# Altium schematic sheet Display.SchDoc
size A4; Organization: Rotronic AG; Address1: Grindelstrasse 6; Address2: 8303 Bassersdorf; Address3: Switzerland; DocumentNumber: 4; SheetNumber: 4; SheetTotal: 10; Web_Address: www.rotronic.ch; E_Mail_Address: *@rotronic.ch; Fon: +41 (0)44 838 11 11; Fax: +41 (0)44 836 44 24
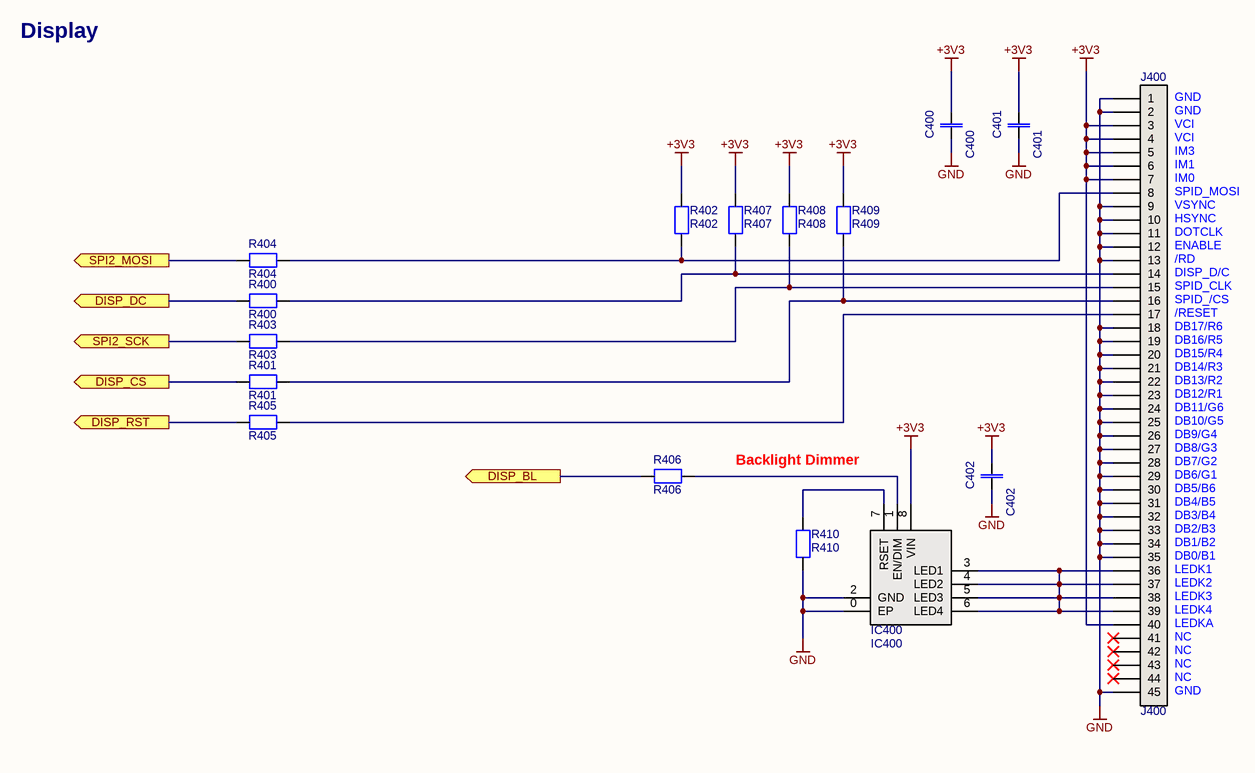
[diagram p0: Display.SchDoc]

## Parts
C400  C400  [0805-2012]
C401  C401  [0603-1608]
C402  C402  [0603-1608]
IC400  IC400  [UDFN-8 517AW-01]
J400  J400  [SAMTEC_ZF5S-45-01-T-WT]
R400  R400  [0603-1608]
R401  R401  [0603-1608]
R402  R402  [0603-1608]
R403  R403  [0603-1608]
R404  R404  [0603-1608]
R405  R405  [0603-1608]
R406  R406  [0603-1608]
R407  R407  [0603-1608]
R408  R408  [0603-1608]
R409  R409  [0603-1608]
R410  R410  [0603-1608]

## Ports
DISP_BL (out), DISP_CS (out), DISP_DC (out), DISP_RST (out), SPI2_MOSI (out), SPI2_SCK (out)

## Nets
+3V3: C400.1 C401.1 C402.1 IC400.8(VIN) J400.3 J400.4 J400.5 J400.6 J400.7 J400.40 R402.2 R407.2 R408.2 R409.2
GND: C400.2 C401.2 C402.2 IC400.0(EP) IC400.2(GND) J400.1 J400.2 J400.9 J400.10 J400.11 J400.12 J400.13 J400.18 J400.19 J400.20 J400.21 J400.22 J400.23 J400.24 J400.25 J400.26 J400.27 J400.28 J400.29 J400.30 J400.31 J400.32 J400.33 J400.34 J400.35 J400.45 R410.2
DISP_BL: R406.2 ; port DISP_BL
DISP_CS: R401.2 ; port DISP_CS
DISP_DC: R400.2 ; port DISP_DC
DISP_RST: R405.2 ; port DISP_RST
SPI2_MOSI: R404.2 ; port SPI2_MOSI
SPI2_SCK: R403.2 ; port SPI2_SCK
NetIC400_1: IC400.1(EN/DIM) R406.1
NetIC400_3: IC400.3(LED1) IC400.4(LED2) IC400.5(LED3) IC400.6(LED4) J400.36 J400.37 J400.38 J400.39
NetIC400_7: IC400.7(RSET) R410.1
NetJ400_8: J400.8 R402.1 R404.1
NetJ400_14: J400.14 R400.1 R407.1
NetJ400_15: J400.15 R403.1 R408.1
NetJ400_16: J400.16 R401.1 R409.1
NetJ400_17: J400.17 R405.1

Not connected (* = marked no-connect by the designer): J400 41* 42* 43* 44*

## Notes on the sheet
- Display
- (near J400) GND
- (near J400) VCI
- (near J400) IM3
- (near J400) IM1
- (near J400) IM0
- (near J400) SPID_MOSI
- (near J400) VSYNC
- (near J400) HSYNC
- (near J400) DOTCLK
- (near J400) ENABLE
- (near J400) /RD
- (near J400) DISP_D/C
- (near J400) /RESET
- (near J400) SPID_/CS
- (near J400) SPID_CLK
- (near J400) DB17/R6
- (near J400) DB16/R5
- (near J400) DB15/R4
- (near J400) DB14/R3
- (near J400) DB13/R2
- (near J400) DB12/R1
- (near J400) DB11/G6
- (near J400) DB8/G3
- (near J400) DB9/G4
- (near J400) DB10/G5
- Backlight Dimmer
- (near J400) DB4/B5
- (near J400) DB5/B6
- (near J400) DB6/G1
- (near J400) DB7/G2
- (near J400) DB0/B1
- (near J400) DB1/B2
- (near J400) DB2/B3
- (near J400) DB3/B4
- (near J400) LEDK1
- (near J400) LEDK2
- (near J400) LEDK3
- (near J400) LEDK4
- (near J400) LEDKA
- (near J400) NC
- Byte Overflow - DIY Electronics projects
- _byteoverflow_
- Revision
- AD-Version
- Designer
- Datum
- elektronisch signiert
- Sheet
- of

## Library data of the parts
C400 = F0127: Capacitor; Part-Number: 63.0105.1500; Manufacturer: Murata Electronics North America; Manufacturer Part Number: GRM21BF51H105ZA12L; Designator: C 1uF 50V; ID: F0127; Operating Range: -30°C to +85°C; Note: 1uF 50V Y5V 20% Murata GRM21BF51H105ZA12L; Specification: 27.12.2012 OPT; Value: 1uF 50V; Component Type: Standard; ComponentLink1Description: Datasheet; ComponentLink1URL: http://www.murata.com/products/catalog/pdf/c02e.pdf; Status: Active; Availability Date: 15.11.2016 OPT; RoHS compliant: Yes; Flammability: n.a.; ComponentLink2Description: http://search.murata.co.jp/Ceramy/image/img/A01X/G101/ENG/GRM21BF51H105ZA12-01.pdf; ComponentLink2URL: http://search.murata.co.jp/Ceramy/image/img/A01X/G101/ENG/GRM21BF51H105ZA12-01.pdf; Pin Count: 2; Price 100: 0.067; Price 1000: 0.067; Price Date: 02.12.2019 Pro Alpha; Changed: 27.12.2012 OPT; Price: 0.118; Supplier Part Number 1: 490-3903-1-ND; Part Status: Discontinued at Digi-Key; RoHS: RoHS Compliant; Supplier 1: Digi-Key
C401 C402 = F0161: Capacitor; Part-Number: 63.0104.1450; Manufacturer: KEMET; Manufacturer Part Number: C0603C104K5RACTU; ID: F0161; Operating Range: -55°C to +125°C; Note: 100nF 50V X7R 10% Kemet C0603C104K5RACTU; Specification: 05.09.2013 OPT; Value: 100nF 50V; Designator: C 100nF 50V X7R; Component Type: Standard; ComponentLink1Description: Datasheet; ComponentLink1URL: http://www.kemet.com/kemet/web/homepage/kechome.nsf/vapubfiles/KEM_C1002_X7R_SMD.pdf/$file/KEM_C1002_X7R_SMD.pdf; Status: Active; Availability Date: 15.11.2016 OPT; RoHS compliant: Yes; Flammability: n.a.; Pin Count: 2; Price 100: 0.007; Price 1000: 0.007; Price Date: 02.12.2019 Pro Alpha; Changed: 05.09.2013 OPT; Price: 0.01; Supplier Part Number 1: 399-5089-1-ND; Part Status: Active; RoHS: RoHS Compliant; Supplier 1: Digi-Key
IC400 = E0058: Driver; Part-Number: 61.4004.2300; Manufacturer: ON Semiconductor; Designator: CAT4004AHU2-GT3; ID: E0058; Operating Range: -40°C to +125°C; Note: ON Semiconductor CAT4004AHU2-GT3 LED-Beleuchtungstreiber LED DR 4 CH EZ DIM I/F; Specification: 13.09.2013 OPT; Verification: 18.09.2014 FUW; Value: CAT4004AHU2-GT3; Component Type: Standard; ComponentLink1Description: Datasheet; ComponentLink1URL: http://www.onsemi.com/pub_link/Collateral/CAT4004A-D.PDF; Status: Active; Availability Date: 15.11.2016 OPT; RoHS compliant: Yes; Flammability: n.a.; Pin Count: 8; Price 100: 0.624; Price 1000: 0.436; Price Date: 02.12.2019 Pro Alpha; Changed: 13.09.2013 OPT; Price: 0.591; Supplier Part Number 1: CAT4004AHU2-GT3OSCT-ND; Manufacturer Part Number: CAT4004AHU2-GT3; Part Status: Active; RoHS: RoHS Compliant; Supplier 1: Digi-Key
J400 = N0180: Connector; Part-Number: 00.0000.0000; Designator: FFC 45 Pos F32Q-1A7H1-11045; ID: N0180; Operating Range: -40°C to +120°C; Note: FFC & FPC-Steckverbinder F31W-1A7H1-11024-Slider type; Specification: 02.04.2022 PEK; Value: FFC 45 Pos F32Q-1A7H1-11045; Component Type: Standard; ComponentLink1Description: Datasheet; ComponentLink1URL: https://cdn.amphenol-cs.com/media/wysiwyg/files/documentation/datasheet/flex/ffc_fpc_050mm_f32r_f32q.pdf; Status: Active; Availability Date: 02.04.2022 PEK; RoHS compliant: Yes; Flammability: UL 94 V-0; Pin Count: 45; Price 100: 1.11; Price 1000: 1.11; Price Date: 02.04.2022 PEK; Changed: 02.04.2022 PEK; Price: 1.11
R400 R401 R403-R406 = Q0011: Resistor; Part-Number: 71.1000.1300; Manufacturer: Vishay Dale; Manufacturer Part Number: CRCW0603100RFKEA; Designator: R 100E 1%; ID: Q0011; Operating Range: -55°C to +155°C; Note: 100E 1% 100ppm 1/10W Vishay / Dale CRCW0603100RFKTB; Changed: 19.09.2011 MLP; Verification: 05.07.2012 OPT; Value: 100E 1%; Component Type: Standard; ComponentLink1Description: http://www.vishay.com/docs/20035/dcrcwe3.pdf; ComponentLink1URL: http://www.vishay.com/docs/20035/dcrcwe3.pdf; Status: Active; Availability Date: 16.11.2016 OPT; RoHS compliant: Yes; Flammability: n.a.; Pin Count: 2; Price 100: 0.002; Price 1000: 0.002; Price Date: 02.12.2019 Pro Alpha; Specification: 19.09.2011 MLP; Price: 0.002; Supplier: Digi-Key; Supplier Part Number: 541-100HCT-ND; Part Status: Active; RoHS: RoHS Compliant
R402 R407-R409 = Q0017: Resistor; Part-Number: 71.1002.1300; Manufacturer: Vishay Dale; Manufacturer Part Number: CRCW060310K0FKEAHP; ID: Q0017; Operating Range: -55°C to +155°C; Note: 10k 1% 100ppm 1/10W Vishay CRCW060310K0FKEA; Changed: 19.09.2011 MLP; Verification: 05.07.2012 OPT; Value: 10k; Designator: R 10k 1%; Component Type: Standard; ComponentLink1Description: http://www.vishay.com/docs/20043/crcwhpe3.pdf; ComponentLink1URL: http://www.vishay.com/docs/20043/crcwhpe3.pdf; Status: Active; Availability Date: 16.11.2016 OPT; RoHS compliant: Yes; Flammability: n.a.; Pin Count: 2; Price 100: 0.002; Price 1000: 0.002; Price Date: 02.12.2019 Pro Alpha; Specification: 19.09.2011 MLP; Price: 0.001; Supplier: Digi-Key; Supplier Part Number: 541-10.0KSCT-ND; Part Status: Active; RoHS: RoHS Compliant
R410 = Q0140: Resistor; Part-Number: 71.3901.1300; Manufacturer: Vishay Dale; Manufacturer Part Number: CRCW06033K90FKEA; Designator: R 3.9k 1%; ID: Q0140; Note: 3.9k 1% 100ppm 1/10W Vishay CRCW06033K90FKEA; Changed: 19.09.2011 MLP; Verification: 05.07.2012 OPT; Value: 3.9k 1%; Component Type: Standard; Operating Range: -; Status: Active; Availability Date: 16.11.2016 OPT; RoHS compliant: Yes; Flammability: n.a.; Pin Count: 2; Price 100: 0.002; Price 1000: 0.002; Price Date: 02.12.2019 Pro Alpha; Specification: 19.09.2011 MLP; Price: 0.002; Supplier: Digi-Key; Supplier Part Number: 541-3.90KHCT-ND; Part Status: Active; RoHS: RoHS Compliant